# EAGLE design HamsterLabsPhotoInterruptor2 (EAGLE 9.2.2)
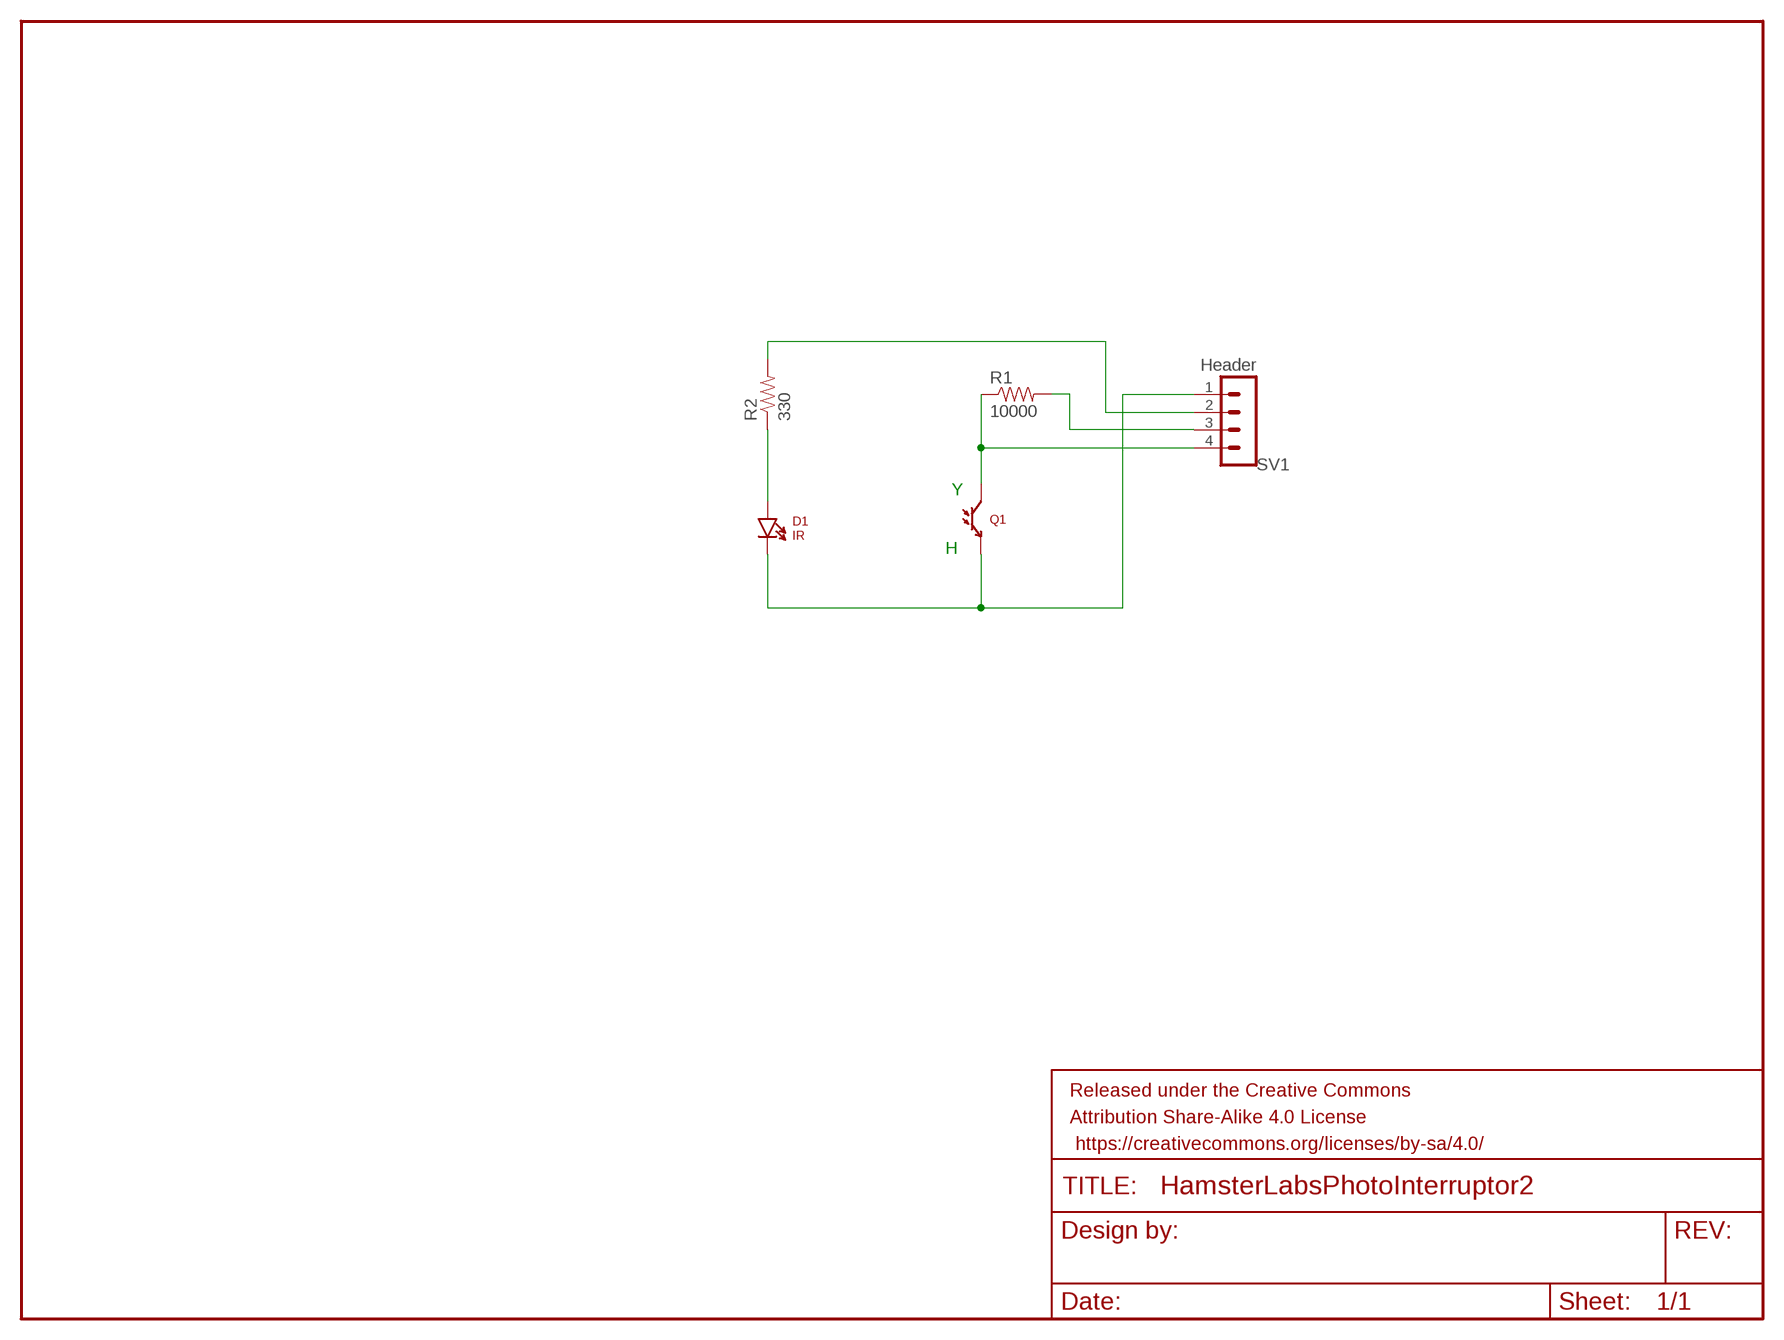
[diagram p0: schematic, sheet 1]

## Parts
D1  IR  LTE-302  [LTE-302]
FRAME1  FRAME-LETTERNO_PACKAGE  [DUMMY]
Q1  LTR-301  [LTR-301]
R1  10000  10KOHM-1/4W-1%(PTH)HORIZ  [AXIAL-0.3]
R2  330  10KOHM-1/4W-1%(PTH)HORIZ  [AXIAL-0.3]
SV1  Header  MA04-1  [MA04-1]

## Nets
N$1: D1.A R2.P$1
N$2: Q1.C R1.P$1 SV1.4
N$3: R1.P$2 SV1.3
N$4: D1.C Q1.E SV1.1
N$5: R2.P$2 SV1.2

## Notes on the sheet
- Y
- H

## Library data of the parts
D1 = SparkFun-LED:LTE-302: Through-hole side-firing 940nm IR LED
FRAME1 = SparkFun-Aesthetics:FRAME-LETTER: Schematic Frame Standard 8.5x11 US Letter frame; DESIGNER: Nobody; VERSION: v01
Q1 = SparkFun-Sensors:LTR-301: Through-hole side-receiving IR phototransistor
R1 R2 = SparkFun-Resistors:10KOHM-1/4W-1%(PTH): RES-12183; PROD_ID: RES-12183; VALUE: 10k
SV1 = con-lstb:MA04-1: PIN HEADER; OC_FARNELL: unknown; OC_NEWARK: unknown

## Board
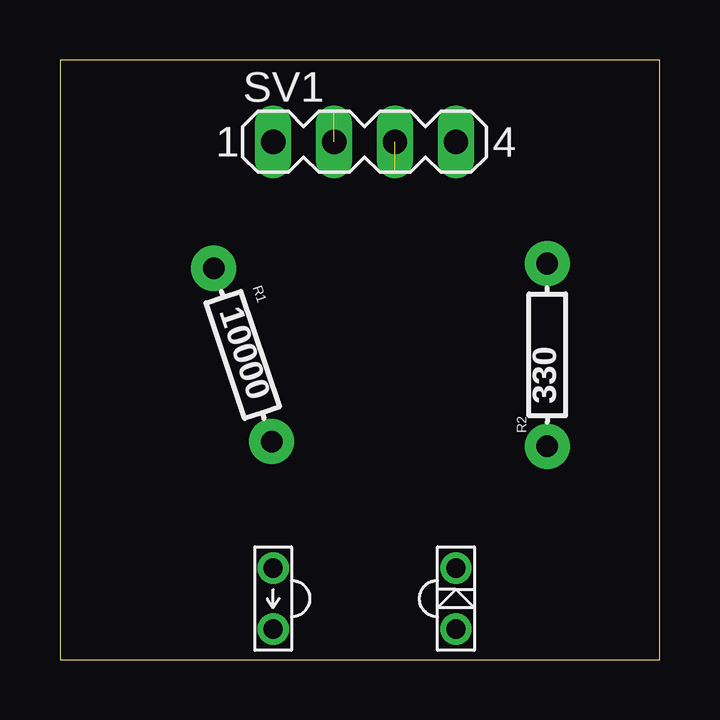
[diagram p1: board, top side]
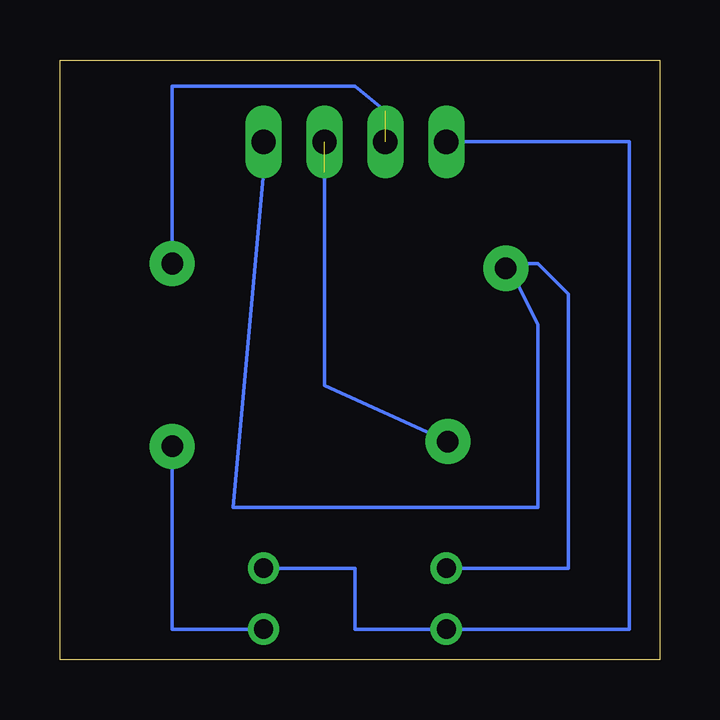
[diagram p2: board, bottom side, seen from below]

Size 25 x 25 mm. Coordinates in mm from the lower left corner, seen from the top.
Outline: 0,0 25,0 25,25 0,25 0,0
Copper layers (1*16): Top 0.035mm / dielectric 1.5mm / Bottom 0.035mm
Design rules "default": minimum track width 6mil, minimum drill 0.35mm, track to track 6mil, track to pad 6mil, pad to pad 6mil, via to via 6mil, smd to smd 6mil, copper to edge 40mil, drill to drill 6mil, minimum pad ring 10mil, minimum via ring 8mil, stop-mask expansion 4mil, vias tented up to drill 0mil, thermal gap 10mil

### Footprints (pad centres in the part's own frame; a part is rotated, then mirrored left to right if it is on the bottom)
LTE-302 = drill 0.8: A 1.27,0; C -1.27,0
LTR-301 = drill 0.8: C 1.27,0; E -1.27,0
AXIAL-0.3 = drill 0.9 pad 1.88: P$1 -3.81,0; P$2 3.81,0
MA04-1 = drill 1.016 long: 1 -3.81,0; 2 -1.27,0; 3 1.27,0; 4 3.81,0

### Placement (x,y rotation side)
D1  16.51,2.54 270 top
FRAME1  -24.13,15.24 0 top  (outside the outline)
Q1  8.89,2.54 90 top
R1  7.62,12.7 288.5 top
R2  20.32,12.7 90 top
SV1  12.7,21.59 0 top

### Tracks (layer width: path | path; a pad name or v marks a point on that pad's centre or on a via)
N$1
  Bottom 0.152: R2.P$1 20.32,1.27 D1.A
N$2
  Bottom 0.152: Q1.C 3.81,3.81 3.81,15.24 5.08,16.51 6.35,16.51 | R1.P$1 6.35,16.51 | 6.35,16.51 5.08,13.97 5.08,6.35 17.78,6.35 16.51,20.32 SV1.4
N$3  (1 unrouted)
  Bottom 0.152: R1.P$2 13.97,11.43 13.97,20.32
N$4
  Bottom 0.152: D1.C 12.7,3.81 12.7,1.27 Q1.E 1.27,1.27 1.27,21.59 SV1.1
N$5  (1 unrouted)
  Bottom 0.152: R2.P$2 20.32,23.91 12.7,23.91 11.43,22.86